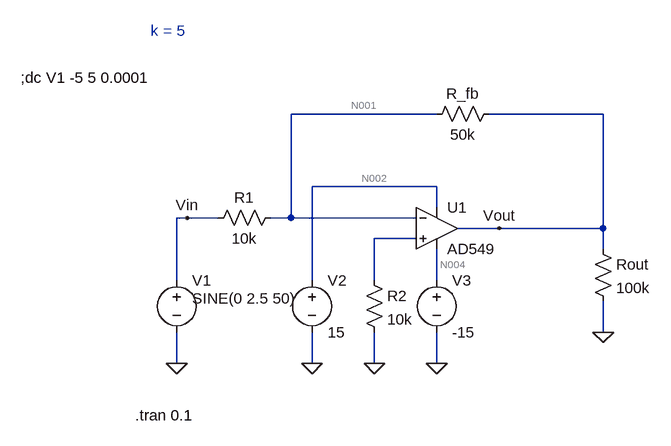
[diagram p0: schematic Draft1.asc]
Draft1.asc, the LTspice schematic file:
Version 4
SHEET 1 880 680
WIRE 224 -16 0 -16
WIRE 480 -16 304 -16
WIRE 224 96 32 96
WIRE 224 128 224 96
WIRE -160 144 -176 144
WIRE -112 144 -160 144
WIRE 0 144 0 -16
WIRE 0 144 -32 144
WIRE 192 144 0 144
WIRE 320 160 256 160
WIRE 480 160 480 -16
WIRE 480 160 320 160
WIRE 192 176 128 176
WIRE 480 192 480 160
WIRE -176 240 -176 144
WIRE 32 240 32 96
WIRE 128 240 128 176
WIRE 224 240 224 192
WIRE 480 320 480 272
WIRE -176 368 -176 320
WIRE 32 368 32 320
WIRE 128 368 128 320
WIRE 224 368 224 320
FLAG 128 368 0
FLAG 480 320 0
FLAG -160 144 Vin
FLAG 320 160 Vout
FLAG -176 368 0
FLAG 32 368 0
FLAG 224 368 0
SYMBOL OpAmps\\AD549 224 96 R0
SYMATTR InstName U1
SYMBOL voltage 32 224 R0
WINDOW 123 0 0 Left 0
WINDOW 39 0 0 Left 0
SYMATTR InstName V2
SYMATTR Value 15
SYMBOL voltage -176 224 R0
WINDOW 3 24 44 Left 2
WINDOW 123 0 0 Left 0
WINDOW 39 0 0 Left 0
SYMATTR Value SINE(0 2.5 50)
SYMATTR InstName V1
SYMBOL voltage 224 224 R0
WINDOW 123 0 0 Left 0
WINDOW 39 0 0 Left 0
SYMATTR InstName V3
SYMATTR Value -15
SYMBOL res -16 128 R90
WINDOW 0 0 56 VBottom 2
WINDOW 3 32 56 VTop 2
SYMATTR InstName R1
SYMATTR Value 10k
SYMBOL res 112 224 R0
SYMATTR InstName R2
SYMATTR Value 10k
SYMBOL res 320 -32 R90
WINDOW 0 0 56 VBottom 2
WINDOW 3 32 56 VTop 2
SYMATTR InstName R_fb
SYMATTR Value 50k
SYMBOL res 464 176 R0
SYMATTR InstName Rout
SYMATTR Value 100k
TEXT -216 -144 Left 2 ;k = 5
TEXT -240 448 Left 2 !.tran 0.1
TEXT -416 -72 Left 2 !;dc V1 -5 5 0.0001

The netlist it stands for:
* Draft1.asc
XU1 N003 N001 N002 N004 Vout AD549  ; pins In+ In- V+ V- OUT
V2 N002 0 15
V1 Vin 0 SINE(0 2.5 50)
V3 N004 0 -15
R1 N001 Vin 10k
R2 N003 0 10k
R_fb Vout N001 50k
Rout Vout 0 100k
* k = 5
.tran 0.1
;dc V1 -5 5 0.0001
.backanno
.end

* Results of the author's LTspice run, read from the files saved beside the schematic
* Operating Point, zero values left out:
*   V(n001) = -359 nV
*   V(n002) = 15 V
*   V(vout) = -2.154 µV
*   V(n004) = -15 V
*   I(R1) = -35.9 pA
*   I(R_fb) = -35.9 pA
*   I(Rout) = -21.54 pA
*   I(V2) = -794.4 µA
*   I(V1) = -35.9 pA
*   I(V3) = 794.4 µA
*   Ix(u1:3) = 794.4 µA
*   Ix(u1:4) = -794.4 µA
*   Ix(u1:5) = 57.43 pA
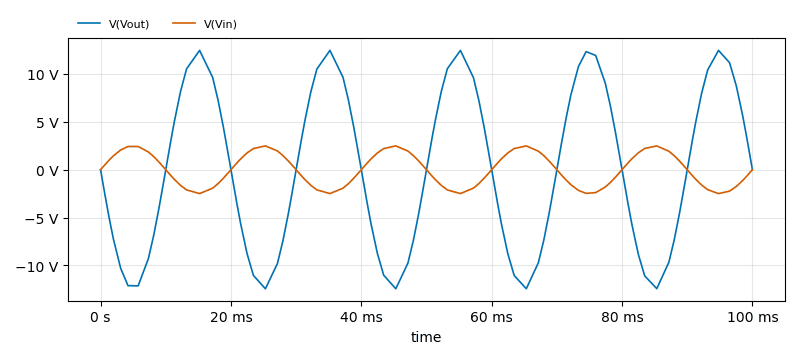
[diagram p1: Transient Analysis of Draft1.asc, plotted from the saved traces]
* Transient Analysis, 1 run:
*   V(Vout): min -12.44 V, max 12.47 V, average -4.741 mV, rms 8.706 V, last 3.626 mV
*   V(Vin): min -2.494 V, max 2.488 V, average 947.9 µV, rms 1.742 V, last 0 V